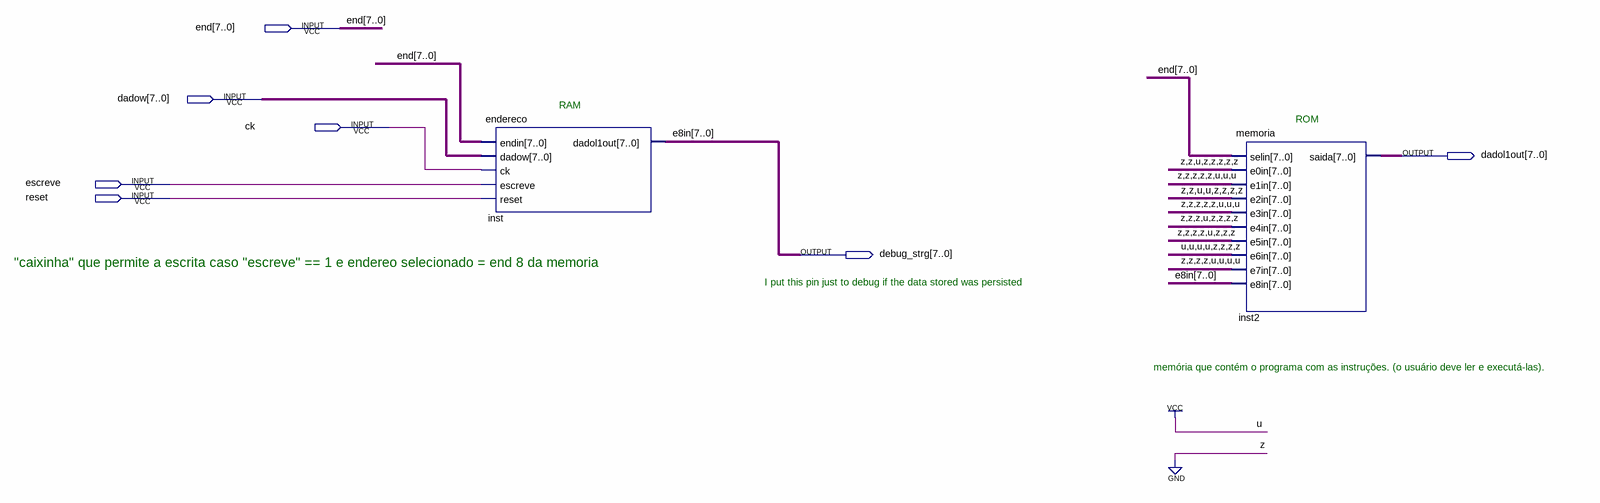
[diagram p0: schematic sheet]
// Quartus schematic memprog.bdf as structural Verilog: 2 symbols, 7 pins
module memprog (
  input  [7:0] \end ,
  input  [7:0] dadow,
  input  ck,
  input  escreve,
  input  reset,
  output [7:0] dadol1out,
  output [7:0] debug_strg
);

  endereco inst (.endin(\end ), .dadow(dadow), .ck(ck), .escreve(escreve), .reset(reset), .dadol1out(debug_strg));
  memoria inst2 (
    .selin(\end ), .e0in(8'b00100000), .e1in(8'b00000111), .e2in(8'b00110000), .e3in(8'b00000111),
    .e4in(8'b00010000), .e5in(8'b00001000), .e6in(8'b11110000), .e7in(8'b00001111), .e8in(debug_strg),
    .saida(dadol1out));

  // Other names for the same wires on the sheet: e8in[7:0] = debug_strg

  // Notes on the sheet:
  //   RAM
  //   ROM
  //   "caixinha" que permite a escrita caso "escreve" == 1 e endereo selecionado = end 8 da memoria
  //   I put this pin just to debug if the data stored was persisted
  //   memória que contém o programa com as instruções. (o usuário deve ler e executá-las).
endmodule
